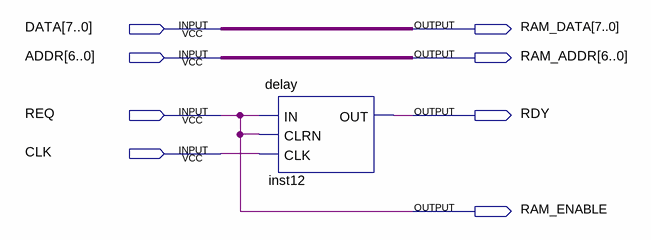
[diagram p0: schematic sheet]
// Quartus schematic device-byte-pusher.bdf as structural Verilog: 1 symbols, 8 pins
module \device-byte-pusher  (
  input  [7:0] DATA,
  input  [6:0] ADDR,
  input  REQ,
  input  CLK,
  output [7:0] RAM_DATA,
  output [6:0] RAM_ADDR,
  output RDY,
  output RAM_ENABLE
);

  delay inst12 (.IN(REQ), .CLRN(REQ), .CLK(CLK), .OUT(RDY));

  assign RAM_ADDR = ADDR;
  assign RAM_DATA = DATA;
  assign RAM_ENABLE = REQ;
endmodule
